# Altium project PCB_OBOB.PrjPcb
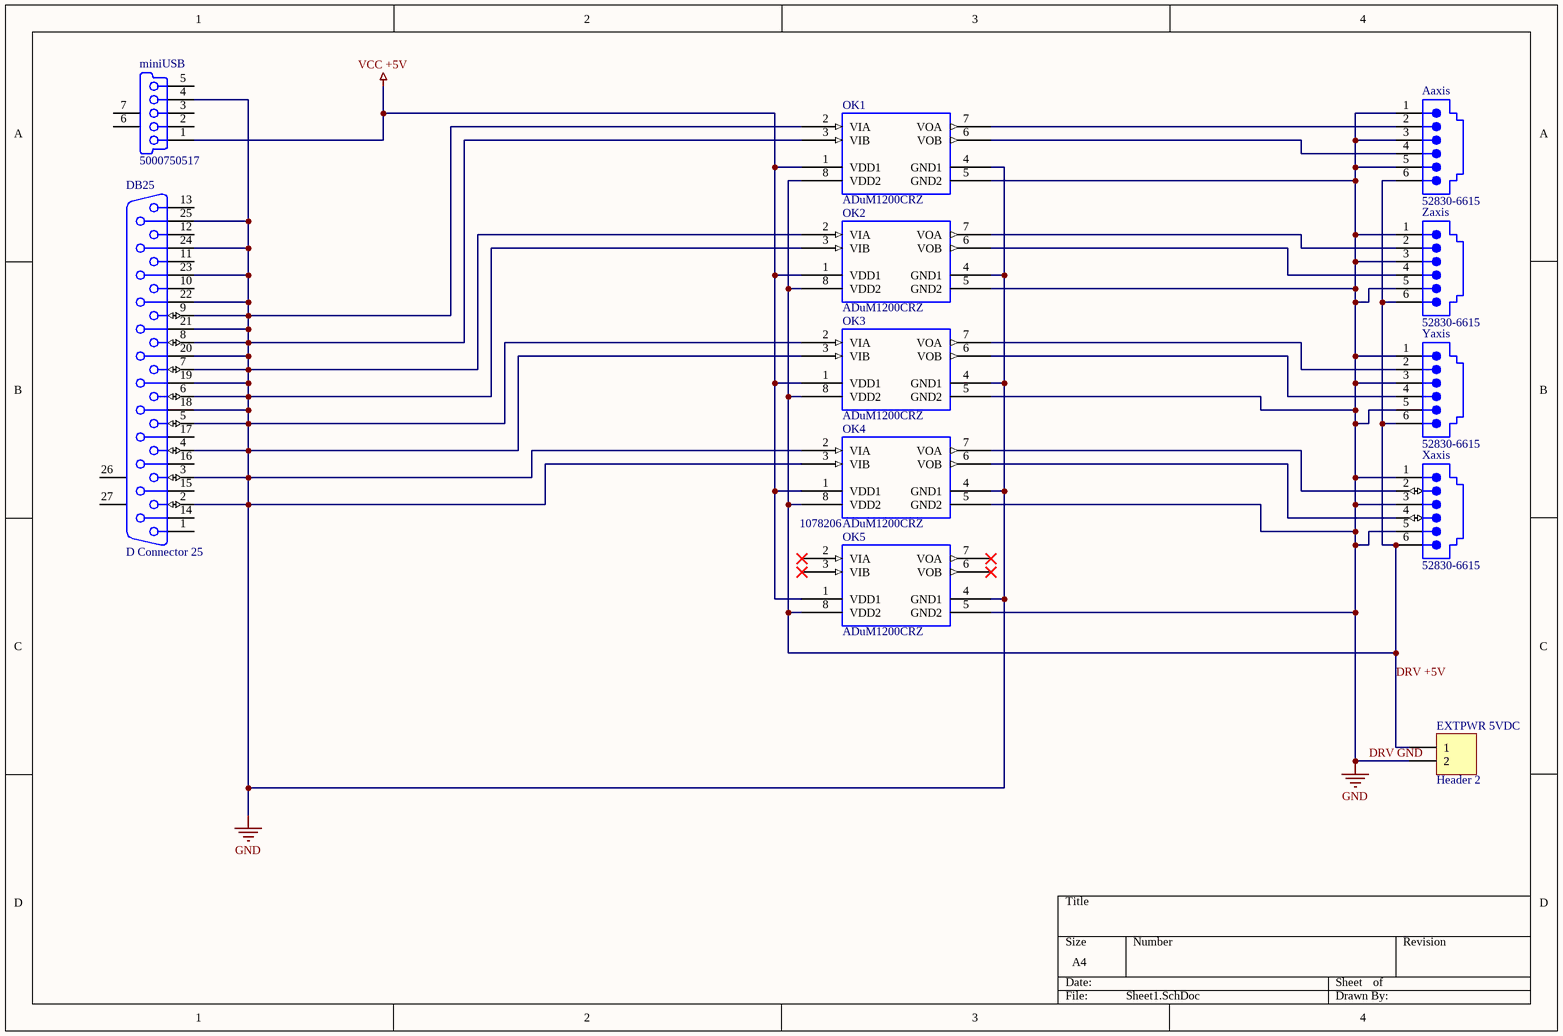
[diagram p0: Sheet1.SchDoc]
1 sheet, 12 parts. Net scope: global (net labels, ports and power ports of the same name join across sheets).
Board file: PCB1.PcbDoc

## Sheet Sheet1.SchDoc
size A4

### Parts
Aaxis  52830-6615  [52830-6615]
DB25  D Connector 25  [DSUB1.385-2H25A]
EXTPWR_5VDC  Header 2  [HDR1X2]
miniUSB  5000750517  [5000750517]
OK1  ADuM1200CRZ  [R-8_N]
OK2  ADuM1200CRZ  [R-8_N]
OK3  ADuM1200CRZ  [R-8_N]
OK4  ADuM1200CRZ  [R-8_N]
OK5  ADuM1200CRZ  Supplier Part Number 1: 1078206  [R-8_N]
Xaxis  52830-6615  [52830-6615]
Yaxis  52830-6615  [52830-6615]
Zaxis  52830-6615  [52830-6615]

### Nets
DRV GND: Aaxis.1 Aaxis.3 Aaxis.5 DB25.2 DB25.3 DB25.4 DB25.5 DB25.6 DB25.7 DB25.8 DB25.9 DB25.18 DB25.19 DB25.20 DB25.21 DB25.22 DB25.23 DB25.24 DB25.25 EXTPWR_5VDC.2 miniUSB.4(ID) OK1.2(VIA) OK1.3(VIB) OK1.4(GND1) OK1.5(GND2) OK2.2(VIA) OK2.3(VIB) OK2.4(GND1) OK2.5(GND2) OK3.2(VIA) OK3.3(VIB) OK3.4(GND1) OK3.5(GND2) OK4.2(VIA) OK4.3(VIB) OK4.4(GND1) OK4.5(GND2) OK5.4(GND1) OK5.5(GND2) Xaxis.1 Xaxis.3 Xaxis.5 Yaxis.1 Yaxis.3 Yaxis.5 Zaxis.1 Zaxis.3 Zaxis.5  [also labelled GND]
VCC +5V: miniUSB.1(V_BUS) OK1.1(VDD1) OK2.1(VDD1) OK3.1(VDD1) OK4.1(VDD1) OK5.1(VDD1)
DRV +5V: Aaxis.6 EXTPWR_5VDC.1 OK1.8(VDD2) OK2.8(VDD2) OK3.8(VDD2) OK4.8(VDD2) OK5.8(VDD2) Xaxis.6 Yaxis.6 Zaxis.6
NetAaxis_2: Aaxis.2 OK1.7(VOA)
NetAaxis_4: Aaxis.4 OK1.6(VOB)
NetOK2_6: OK2.6(VOB) Zaxis.4
NetOK2_7: OK2.7(VOA) Zaxis.2
NetOK3_6: OK3.6(VOB) Yaxis.4
NetOK3_7: OK3.7(VOA) Yaxis.2
NetOK4_6: OK4.6(VOB) Xaxis.4
NetOK4_7: OK4.7(VOA) Xaxis.2

Not connected (* = marked no-connect by the designer): DB25 1 10 11 12 13 14 15 16 17 26(MH1) 27(MH2); miniUSB 2(D-) 3(D+) 5(GND) 6(MH1) 7(MH2); OK5 2(VIA)* 3(VIB)* 6(VOB)* 7(VOA)*

### Library data of the parts
Aaxis Xaxis Yaxis Zaxis = 52830-6615: Right Angle, Standard Profile, with Metal Peg PCB Jack; Ports: 1; Positions/Loaded: Port1 - 6/6; PerformanceCategory: 3; PCB_Mounting: Thru-Hole; DrillSize: Nominal, Rounded to nearest 0.05mm; PCB_Layout: Complies with Manufacturer's Recommendation.; Published: 25-Jun-2002; DatasheetDocument: 18-Dec-2001; PackageDocument: 18-Dec-2001; PackageReference: 52830-6615; Publisher: Altium Limited; ComponentLink1Description: Manufacturer Link; ComponentLink1URL: http://www.molex.com/; ComponentLink2Description: Datasheet; ComponentLink2URL: http://www.molex.com/cmc_upload/common_files/1212003_mx52830.pdf; ComponentLink3Description: Iges Model; ComponentLink3URL: http://www.molex.com/pdm_docs/igs/52830-4215_igs.zip
DB25 = D Connector 25: Receptacle Assembly, 25 Position, Right Angle; PackageDocument: U; Positions: 25; Published: 15-Jun-2001; LatestRevisionDate: 17-Jul-2002; LatestRevisionNote: Re-released for DXP Platform.; DatasheetDocument: 19-Mar-1999; PackageReference: 787202; Publisher: Altium Limited; Orientation: Right Angle; Gender: Receptacle
EXTPWR_5VDC = Header 2: Header, 2-Pin; LatestRevisionDate: 17-Jul-2002; LatestRevisionNote: Re-released for DXP Platform.; Publisher: Altium Limited
miniUSB = 5000750517: USB On-The-Go (OTG) Mini-B Receptacle, Right Angle, Thru-Hole, 0.80mm (.031") Pitch, Solder Tails & Shell Tabs with Dimples; PCB_Layout: Complies with Manufacturer's Recommendation.; Published: 30-May-2008; DatasheetVersion: rev0, Mar-2004; PackageVersion: rev0, Mar-2004; PackageReference: 5000750517; Publisher: Altium Limited; PackageDescription: USB Mini-B, Type 2, Thru-Hole; 5 Position; Vertical, Body 7.7 x 4.2 x 7.7 mm (LxWxH); ComponentLink1Description: Manufacturer Link; ComponentLink1URL: http://www.molex.com/; ComponentLink2Description: Datasheet; ComponentLink2URL: http://www.molex.com/pdm_docs/sd/5000750517_sd.pdf
OK1 = ADuM1200CRZ: iCoupler; BodyName: *; Instance: *; PartName: *; PLACEMENT_REGION: *; CompValue: *; Right: *; Bottom: *; SymName: *; RefLocation: *; BoardLocation: *; SlotXofY: *
OK2-OK5 = ADuM1200CRZ: BodyName: *; Instance: *; PartName: *; PLACEMENT_REGION: *; CompValue: *; Right: *; Bottom: *; SymName: *; RefLocation: *; BoardLocation: *; SlotXofY: *
  OK5: Supplier 1: Farnell